# Altium project DemoCatV2.PrjPCB
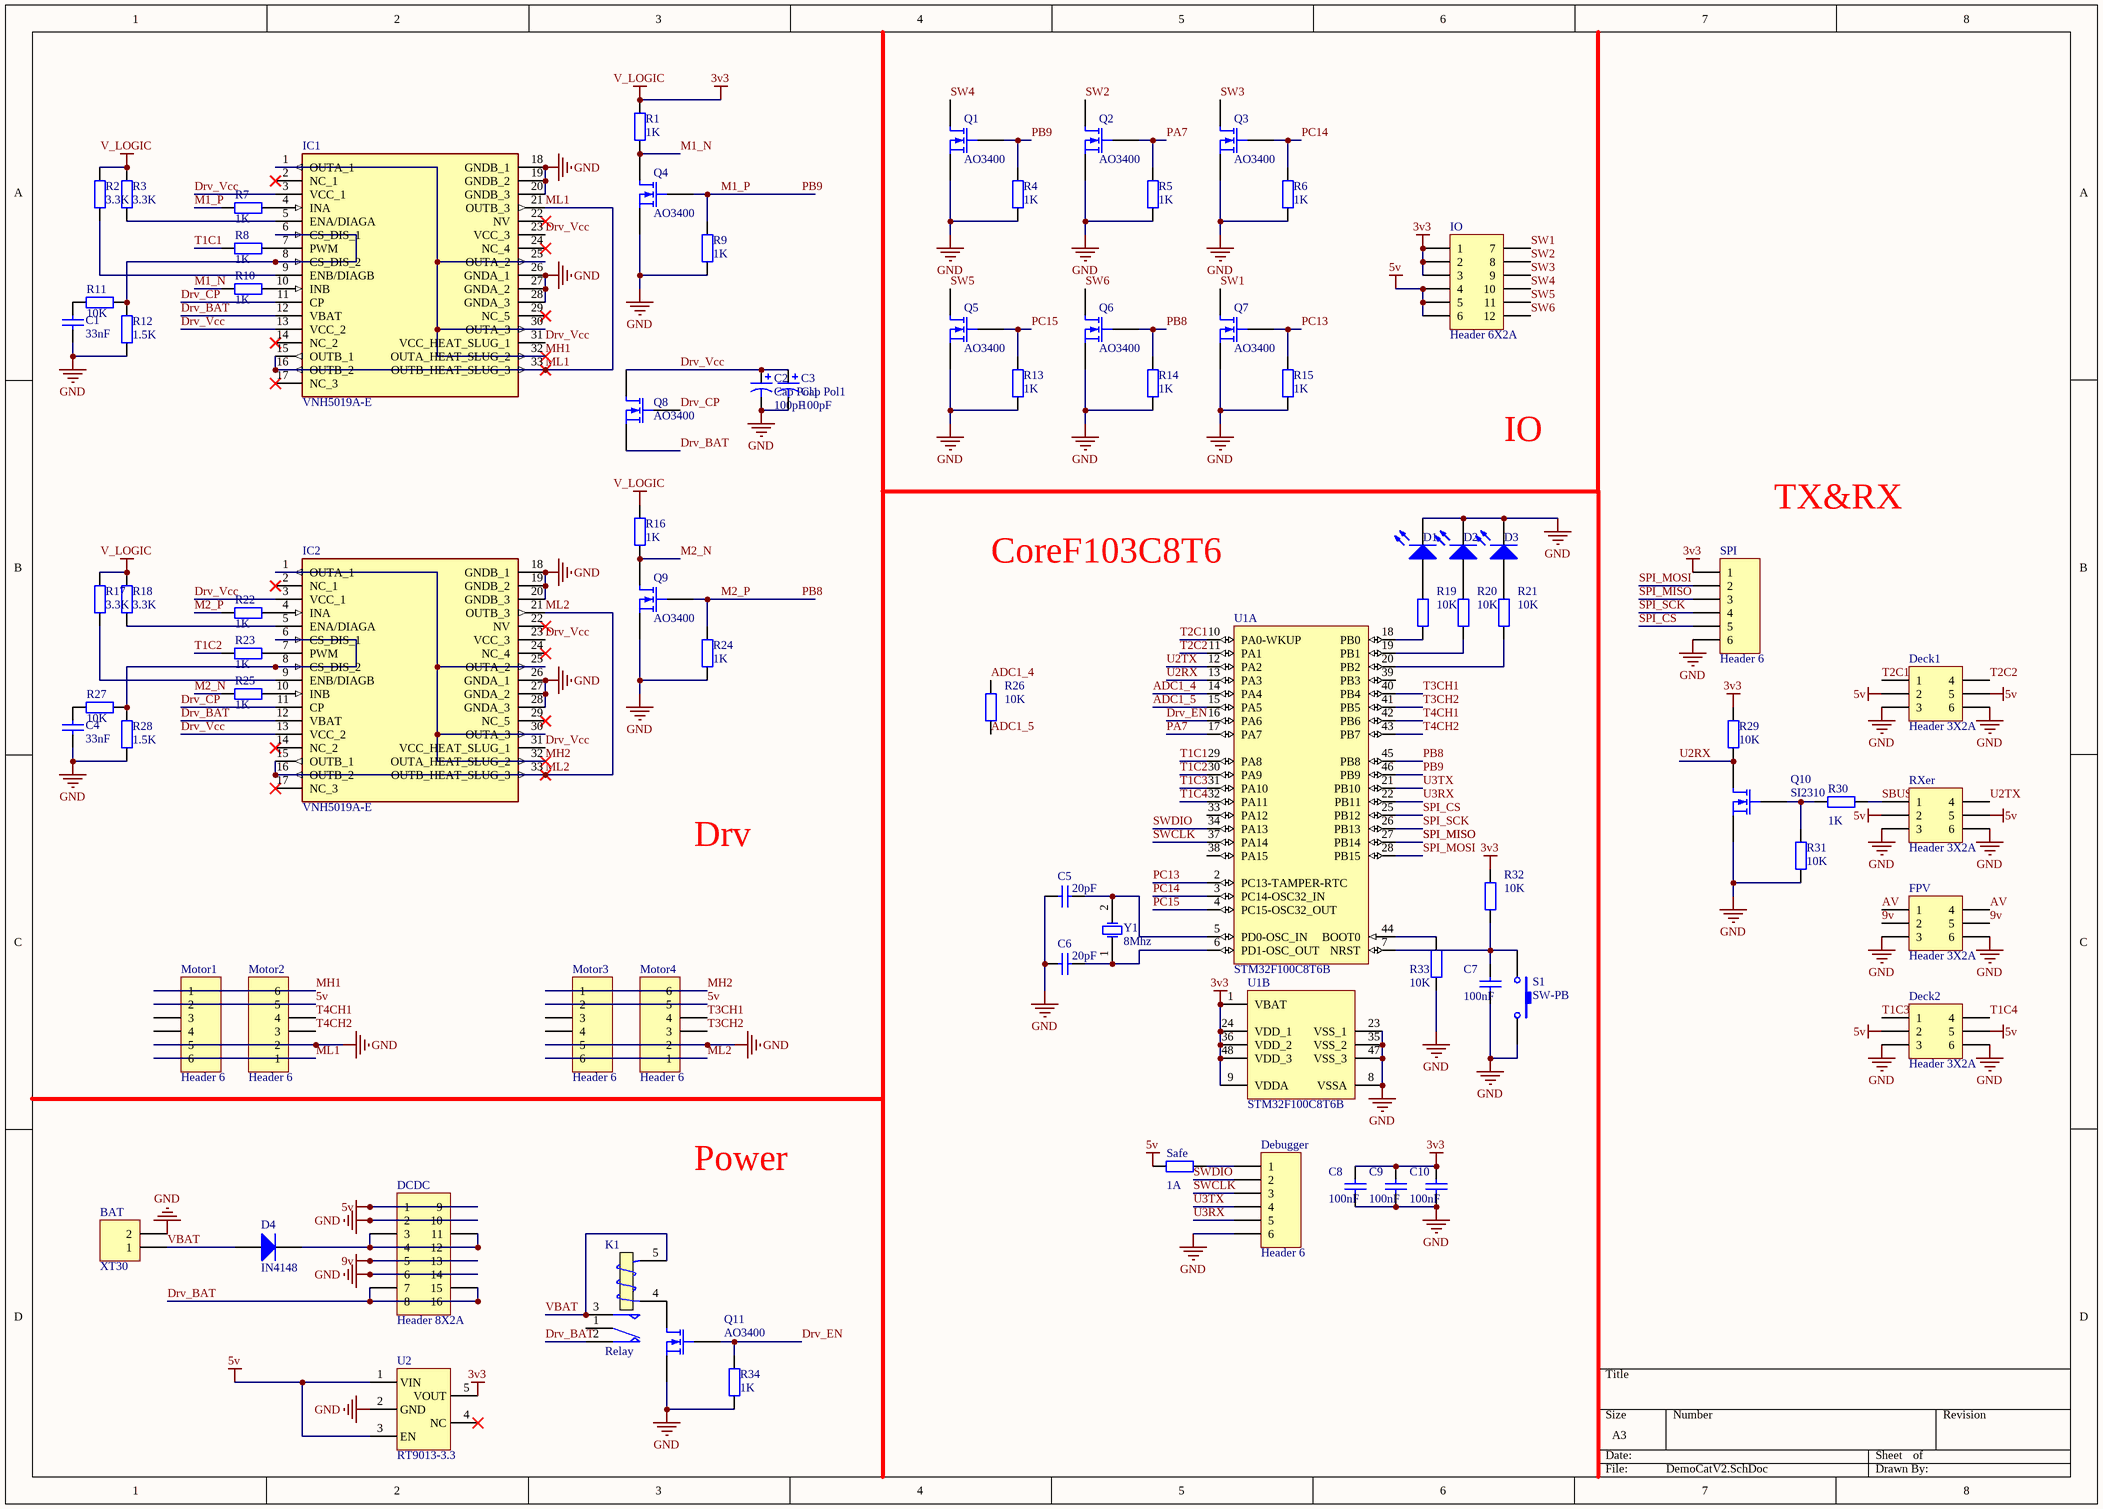
[diagram p0: DemoCatV2.SchDoc]
1 sheet, 80 parts. Net scope: global (net labels, ports and power ports of the same name join across sheets).
Board file: DemoCatV2.PcbDoc

## Sheet DemoCatV2.SchDoc
size A3

### Parts
BAT  XT30  [XT30-IN-W]
C1  value 33nF  [0603C]  (hidden comment: Cap)
C2  Cap Pol1  value 100pF  [6.3*7.7-c]
C3  Cap Pol1  value 100pF  [6.3*7.7-c]
C4  value 33nF  [0603C]  (hidden comment: Cap)
C5  value 20pF  [0603C]  (hidden comment: Cap)
C6  value 20pF  [0603C]  (hidden comment: Cap)
C7  value 100nF  [0603C]  (hidden comment: Cap)
C8  value 100nF  [0603C]  (hidden comment: Cap)
C9  value 100nF  [0603C]  (hidden comment: Cap)
C10  value 100nF  [0603C]  (hidden comment: Cap)
D1  LED0  [0603LED - Red]  (value not drawn)
D2  LED0  [0603LED - Green]  (value not drawn)
D3  LED0  [0603LED - Blue]  (value not drawn)
D4  IN4148  [DO-214AA(SMB)]
DCDC  Header 8X2A  [HDR_EDGE_2x8]
Debugger  Header 6  [GX1.25_T_6P]
Deck1  Header 3X2A  [HDR_EDGE_2x3]
Deck2  Header 3X2A  [HDR_EDGE_2x3]
FPV  Header 3X2A  [HDR_EDGE_2x3]
IC1  VNH5019A-E  [VNH5019A-E_1]
IC2  VNH5019A-E  [VNH5019A-E_1]
IO  Header 6X2A  [HDR_EDGE_2x6]
K1  Relay  [RY-HF46-HS1]
Motor1  Header 6  [PH-PS-2.0-6]
Motor2  Header 6  [PH-PS-2.0-6]
Motor3  Header 6  [PH-PS-2.0-6]
Motor4  Header 6  [PH-PS-2.0-6]
Q1  AO3400  [SOT-23-MOS]
Q2  AO3400  [SOT-23-MOS]
Q3  AO3400  [SOT-23-MOS]
Q4  AO3400  [SOT-23-MOS]
Q5  AO3400  [SOT-23-MOS]
Q6  AO3400  [SOT-23-MOS]
Q7  AO3400  [SOT-23-MOS]
Q8  AO3400  [TO-252-3]
Q9  AO3400  [SOT-23-MOS]
Q10  SI2310  [SOT-23-MOS]
Q11  AO3400  [SOT-23-MOS]
R1  value 1K  [0603R]  (hidden comment: Res2)
R2  value 3.3K  [0603R]  (hidden comment: Res2)
R3  value 3.3K  [0603R]  (hidden comment: Res2)
R4  value 1K  [0603R]  (hidden comment: Res2)
R5  value 1K  [0603R]  (hidden comment: Res2)
R6  value 1K  [0603R]  (hidden comment: Res2)
R7  value 1K  [0603R]  (hidden comment: Res2)
R8  value 1K  [0603R]  (hidden comment: Res2)
R9  value 1K  [0603R]  (hidden comment: Res2)
R10  value 1K  [0603R]  (hidden comment: Res2)
R11  value 10K  [0603R]  (hidden comment: Res2)
R12  value 1.5K  [0603R]  (hidden comment: Res2)
R13  value 1K  [0603R]  (hidden comment: Res2)
R14  value 1K  [0603R]  (hidden comment: Res2)
R15  value 1K  [0603R]  (hidden comment: Res2)
R16  value 1K  [0603R]  (hidden comment: Res2)
R17  value 3.3K  [0603R]  (hidden comment: Res2)
R18  value 3.3K  [0603R]  (hidden comment: Res2)
R19  10K  [0603R]
R20  10K  [0603R]
R21  10K  [0603R]
R22  value 1K  [0603R]  (hidden comment: Res2)
R23  value 1K  [0603R]  (hidden comment: Res2)
R24  value 1K  [0603R]  (hidden comment: Res2)
R25  value 1K  [0603R]  (hidden comment: Res2)
R26  10K  [1206R]
R27  value 10K  [0603R]  (hidden comment: Res2)
R28  value 1.5K  [0603R]  (hidden comment: Res2)
R29  value 10K  [0603R]  (hidden comment: Res2)
R30  value 1K  [0603R]  (hidden comment: Res2)
R31  value 10K  [0603R]  (hidden comment: Res2)
R32  10K  [0603R]
R33  value 10K  [0603R]  (hidden comment: Res2)
R34  value 1K  [0603R]  (hidden comment: Res2)
RXer  Header 3X2A  [HDR_EDGE_2x3]
S1  SW-PB  [KeySwitch-3X3]
Safe  value 1A  [0805R]  (hidden comment: Res2)
SPI  Header 6  [GX1.25_T_6P]
U1  STM32F100C8T6B  [LQFN-48]  (parts A,B of 2)
U2  RT9013-3.3  [SOT-23-5]
Y1  8Mhz  [OSC 3215-2P]

### Nets
3v3: C8.2 C9.2 C10.2 IO.1 IO.2 IO.3 R1.2 R2.2 R3.2 R16.2 R17.2 R18.2 R29.2 R32.2 SPI.1 U1.1(VBAT) U1.9(VDDA) U1.24(VDD_1) U1.36(VDD_2) U1.48(VDD_3) U2.5(VOUT)  [also labelled V_LOGIC]
5v: DCDC.1 DCDC.9 Deck1.2 Deck1.5 Deck2.2 Deck2.5 IO.4 IO.5 IO.6 Motor1.2 Motor2.5 Motor3.2 Motor4.5 RXer.2 RXer.5 Safe.1 U2.1(VIN) U2.3(EN)
9v: DCDC.5 DCDC.13 FPV.2 FPV.5
GND: BAT.2 C1.1 C2.2 C3.2 C4.1 C5.1 C6.1 C7.1 C8.1 C9.1 C10.1 D1.2(K) D2.2(K) D3.2(K) DCDC.2 DCDC.6 DCDC.10 DCDC.14 Debugger.6 Deck1.3 Deck1.6 Deck2.3 Deck2.6 FPV.3 FPV.6 IC1.18(GNDB_1) IC1.19(GNDB_2) IC1.20(GNDB_3) IC1.26(GNDA_1) IC1.27(GNDA_2) IC1.28(GNDA_3) IC2.18(GNDB_1) IC2.19(GNDB_2) IC2.20(GNDB_3) IC2.26(GNDA_1) IC2.27(GNDA_2) IC2.28(GNDA_3) Motor1.5 Motor2.2 Motor3.5 Motor4.2 Q1.3(S) Q2.3(S) Q3.3(S) Q4.3(S) Q5.3(S) Q6.3(S) Q7.3(S) Q9.3(S) Q10.3(S) Q11.3(S) R4.1 R5.1 R6.1 R9.1 R12.1 R13.1 R14.1 R15.1 R24.1 R28.1 R31.1 R33.1 R34.1 RXer.3 RXer.6 S1.2 SPI.6 U1.8(VSSA) U1.23(VSS_1) U1.35(VSS_2) U1.47(VSS_3) U2.2(GND)
ADC1_4: R26.2 U1.14(PA4)
ADC1_5: R26.1 U1.15(PA5)
AV: FPV.1 FPV.4
Drv_BAT: DCDC.7 DCDC.8 DCDC.15 DCDC.16 IC1.12(VBAT) IC2.12(VBAT) K1.2(NC) Q8.3(S)
Drv_CP: IC1.11(CP) IC2.11(CP) Q8.2(G)
Drv_EN: Q11.2(G) R34.2 U1.16(PA6)
Drv_Vcc: C2.1 C3.1 IC1.3(VCC_1) IC1.13(VCC_2) IC1.23(VCC_3) IC1.31(VCC_HEAT_SLUG_1) IC2.3(VCC_1) IC2.13(VCC_2) IC2.23(VCC_3) IC2.31(VCC_HEAT_SLUG_1) Q8.1(D)
M1_N: Q4.1(D) R1.1 R10.2
M1_P: Q1.2(G) Q4.2(G) R4.2 R7.2 R9.2 U1.46(PB9)  [also labelled PB9]
M2_N: Q9.1(D) R16.1 R25.2
M2_P: Q6.2(G) Q9.2(G) R14.2 R22.2 R24.2 U1.45(PB8)  [also labelled PB8]
MH1: IC1.1(OUTA_1) IC1.25(OUTA_2) IC1.30(OUTA_3) IC1.32(OUTA_HEAT_SLUG_2) Motor1.1 Motor2.6
MH2: IC2.1(OUTA_1) IC2.25(OUTA_2) IC2.30(OUTA_3) IC2.32(OUTA_HEAT_SLUG_2) Motor3.1 Motor4.6
ML1: IC1.15(OUTB_1) IC1.16(OUTB_2) IC1.21(OUTB_3) IC1.33(OUTB_HEAT_SLUG_3) Motor1.6 Motor2.1
ML2: IC2.15(OUTB_1) IC2.16(OUTB_2) IC2.21(OUTB_3) IC2.33(OUTB_HEAT_SLUG_3) Motor3.6 Motor4.1
PA7: Q2.2(G) R5.2 U1.17(PA7)
PC13: Q7.2(G) R15.2 U1.2(PC13-TAMPER-RTC)
PC14: Q3.2(G) R6.2 U1.3(PC14-OSC32_IN)
PC15: Q5.2(G) R13.2 U1.4(PC15-OSC32_OUT)
SBUS: R30.2 RXer.1
SPI_CS: SPI.5 U1.25(PB12)
SPI_MISO: SPI.3 U1.27(PB14)
SPI_MOSI: SPI.2 U1.28(PB15)
SPI_SCK: SPI.4 U1.26(PB13)
SW1: IO.7 Q7.1(D)
SW2: IO.8 Q2.1(D)
SW3: IO.9 Q3.1(D)
SW4: IO.10 Q1.1(D)
SW5: IO.11 Q5.1(D)
SW6: IO.12 Q6.1(D)
SWCLK: Debugger.3 U1.37(PA14)
SWDIO: Debugger.2 U1.34(PA13)
T1C1: R8.2 U1.29(PA8)
T1C2: R23.2 U1.30(PA9)
T1C3: Deck2.1 U1.31(PA10)
T1C4: Deck2.4 U1.32(PA11)
T2C1: Deck1.1 U1.10(PA0-WKUP)
T2C2: Deck1.4 U1.11(PA1)
T3CH1: Motor4.4 U1.40(PB4)
T3CH2: Motor4.3 U1.41(PB5)
T4CH1: Motor2.4 U1.42(PB6)
T4CH2: Motor2.3 U1.43(PB7)
U2RX: Q10.1(D) R29.1 U1.13(PA3)
U2TX: RXer.4 U1.12(PA2)
U3RX: Debugger.5 U1.22(PB11)
U3TX: Debugger.4 U1.21(PB10)
VBAT: BAT.1 D4.1(A) K1.3(NO) K1.5(T2)
NetC1_2: C1.2 R11.2
NetC4_2: C4.2 R27.2
NetC5_2: C5.2 U1.5(PD0-OSC_IN) Y1.2(OSC2)
NetC6_2: C6.2 U1.6(PD1-OSC_OUT) Y1.1(OSC1)
NetC7_2: C7.2 R32.1 S1.1 U1.7(NRST)
NetD1_1: D1.1(A) R19.2
NetD2_1: D2.1(A) R20.2
NetD3_1: D3.1(A) R21.2
NetD4_2: D4.2(K) DCDC.3 DCDC.4 DCDC.11 DCDC.12
NetDebugger_1: Debugger.1 Safe.2
NetIC1_4: IC1.4(INA) R7.1
NetIC1_5: IC1.5(ENA/DIAGA) R3.1
NetIC1_6: IC1.6(CS_DIS_1) IC1.8(CS_DIS_2) R11.1 R12.2
NetIC1_7: IC1.7(PWM) R8.1
NetIC1_9: IC1.9(ENB/DIAGB) R2.1
NetIC1_10: IC1.10(INB) R10.1
NetIC2_4: IC2.4(INA) R22.1
NetIC2_5: IC2.5(ENA/DIAGA) R18.1
NetIC2_6: IC2.6(CS_DIS_1) IC2.8(CS_DIS_2) R27.1 R28.2
NetIC2_7: IC2.7(PWM) R23.1
NetIC2_9: IC2.9(ENB/DIAGB) R17.1
NetIC2_10: IC2.10(INB) R25.1
NetK1_4: K1.4(T1) Q11.1(D)
NetQ10_2: Q10.2(G) R30.1 R31.2
NetR19_1: R19.1 U1.18(PB0)
NetR20_1: R20.1 U1.19(PB1)
NetR21_1: R21.1 U1.20(PB2)
NetR33_2: R33.2 U1.44(BOOT0)

Not connected (* = marked no-connect by the designer): IC1 2(NC_1)* 14(NC_2)* 17(NC_3)* 22(NV)* 24(NC_4)* 29(NC_5)*; IC2 2(NC_1)* 14(NC_2)* 17(NC_3)* 22(NV)* 24(NC_4)* 29(NC_5)*; K1 1(COM); Motor1 3 4; Motor3 3 4; U1 33(PA12) 38(PA15) 39(PB3); U2 4(NC)*

### Notes on the sheet
- IO
- TX&RX
- CoreF103C8T6
- Drv
- Power

### Library data of the parts
BAT = Header 2: Header, 2-Pin; LatestRevisionDate: 17-Jul-2002; LatestRevisionNote: Re-released for DXP Platform.; Publisher: Altium Limited
C1 C4-C10 = Cap: Capacitor; Published: 8-Jun-2000; LatestRevisionDate: 17-Jul-2002; LatestRevisionNote: Re-released for DXP Platform.; PackageReference: RAD-0.3; Publisher: Altium Limited; PackageDescription: Radial Cap, Thru-Hole; 2 Leads; 0.3 in Pin Spacing
C2 C3 = Cap Pol1: Polarized Capacitor (Radial); Published: 8-Jun-2000; LatestRevisionDate: 17-Jul-2002; LatestRevisionNote: Re-released for DXP Platform.; PackageReference: RB7.6-15; Publisher: Altium Limited; PackageDescription: Polarized Capacitor (Radial); 2 Leads
D1-D3 = LED0: Typical INFRARED GaAs LED; Published: 8-Jun-2000; LatestRevisionDate: 08-Jul-2005; LatestRevisionNote: Mech Layer 1 removed.; PackageReference: LED-0; Publisher: Altium Limited; PackageDescription: LED; 2 Leads
D4 = Diode: Default Diode; Published: 8-Jun-2000; LatestRevisionDate: 17-Jul-2002; LatestRevisionNote: Re-released for DXP Platform.; PackageVersion: Sep-1996; PackageReference: SMC; Publisher: Altium Limited; PackageDescription: DO-214-AB/SMC; 2 C-Bend Leads; Body 7.9 x 5.9 mm, inc. leads (LxW); Code_JEDEC: DO-214-AB
DCDC = Header 8X2A: Header, 8-Pin, Dual row; LatestRevisionDate: 17-Jul-2002; LatestRevisionNote: Re-released for DXP Platform.; Publisher: Altium Limited
Debugger Motor1-Motor4 SPI = Header 6: Header, 6-Pin; LatestRevisionDate: 17-Jul-2002; LatestRevisionNote: Re-released for DXP Platform.; Publisher: Altium Limited
Deck1 Deck2 FPV RXer = Header 3X2A: Header, 3-Pin, Dual row; LatestRevisionDate: 17-Jul-2002; LatestRevisionNote: Re-released for DXP Platform.; Publisher: Altium Limited
IC1 IC2 = VNH5019A-E: Integrated Circuit; Manufacturer_Name: STMicroelectronics; Datasheet Link: http://docs-emea.rs-online.com/webdocs/140d/0900766b8140dac2.pdf; Manufacturer_Part_Number: VNH5019A-E; Mouser Part Number: 511-VNH5019A-E; Mouser Price/Stock: https://www.mouser.com/Search/Refine.aspx?Keyword=511-VNH5019A-E; RS Part Number: 8805550P; RS Price/Stock: http://uk.rs-online.com/web/p/products/8805550P
IO = Header 6X2A: Header, 6-Pin, Dual row; LatestRevisionDate: 17-Jul-2002; LatestRevisionNote: Re-released for DXP Platform.; Publisher: Altium Limited
K1 = Relay: SPDT Relay; Published: 8-Jun-2000; LatestRevisionDate: 17-Jul-2002; LatestRevisionNote: Re-released for DXP Platform.; PackageReference: MODULE5B; Publisher: Altium Limited
Q1-Q11 = MOSFET-N: N-Channel MOSFET; Published: 8-Jun-2000; LatestRevisionDate: 17-Jul-2002; LatestRevisionNote: Re-released for DXP Platform.; PackageVersion: 1995/1996; PackageReference: E3; Publisher: Altium Limited; PackageDescription: TO, Flat Index; 3 In-Line, Axial Leads; Body Dia. 4.6mm; Lead Dia. 0.5 mm (max)
R1-R34 Safe = Res2: Resistor; Published: 8-Jun-2000; LatestRevisionDate: 17-Jul-2002; LatestRevisionNote: Re-released for DXP Platform.; PackageReference: AXIAL-0.4; Publisher: Altium Limited; PackageDescription: Axial Device, Thru-Hole; 2 Leads; 0.4 in Pin Spacing
  R19-R21 R26 R32: Value: 10K
S1 = SW-PB: Switch; Published: 24-Mar-1999; LatestRevisionDate: 17-Jul-2002; LatestRevisionNote: Re-released for DXP Platform.; PackageReference: SPST-2; Publisher: Altium Limited; PackageDescription: Switch; 2 Leads
U1 = STM32F100C8T6B: ARM Cortex-M3 32-bit MCU, 64 KB Flash, 8 KB Internal RAM, 37 I/Os, 48-pin LQFP, -40 to 85 degC, Tray; A/D Converter: 1x12-bit (10 Channel); D/A Converter: 2x12-bit (2 Channel); FLASH Size (Prog) (kB): 64; I/Os (High Current): 37; Internal RAM Size (kB): 8; Operating Frequency(F) (Processor speed) (MHz): 24; Supply Voltage(Vcc) min (V): 2; DatasheetVersion: Rev. 7; PackageVersion: Rev. 6, 06/2013; PackageReference: LQFP48; PackageDescription: 48-Pin Low Profile Quad Flat Package, 7 x 7 mm Body, 0.5 mm Pitch; Supplier 1: Digi-Key; Supplier Part Number 1: 497-10499-ND; Supplier 2: Farnell; Supplier Part Number 2: 1838511; Supplier 3: Newark; Supplier Part Number 3: 76R0988; Supplier 4: Mouser; Supplier Part Number 4: 511-STM32F100C8T6B; Core: ARM Cortex-M3; Packing: Tray; Mounting Technology: Surface Mount; PartNumber: STM32F100C8T6B; ComponentLink1Description: Manufacturer URL; ComponentLink1URL: http://www.st.com/web/en/home.html; ComponentLink2Description: Datasheet; ComponentLink2URL: http://www.st.com/st-web-ui/static/active/en/resource/technical/document/datasheet/CD00251732.pdf; ComponentLink3Description: Package Specification; ComponentLink3URL: http://www.st.com/st-web-ui/static/active/en/resource/technical/document/datasheet/DM00058181.pdf
U2 = RT9013: 3.3V 500mA
Y1 = XTAL: Published: 8-Jun-2000; LatestRevisionDate: 17-Jul-2002; LatestRevisionNote: Re-released for DXP Platform.; PackageReference: R38; Publisher: Altium Limited; PackageDescription: Crystal, Thru-Hole; 2 Leads; Body 3.1 x 8.2 mm (Dia.xH)